# EAGLE design drawdio (EAGLE 5.01)
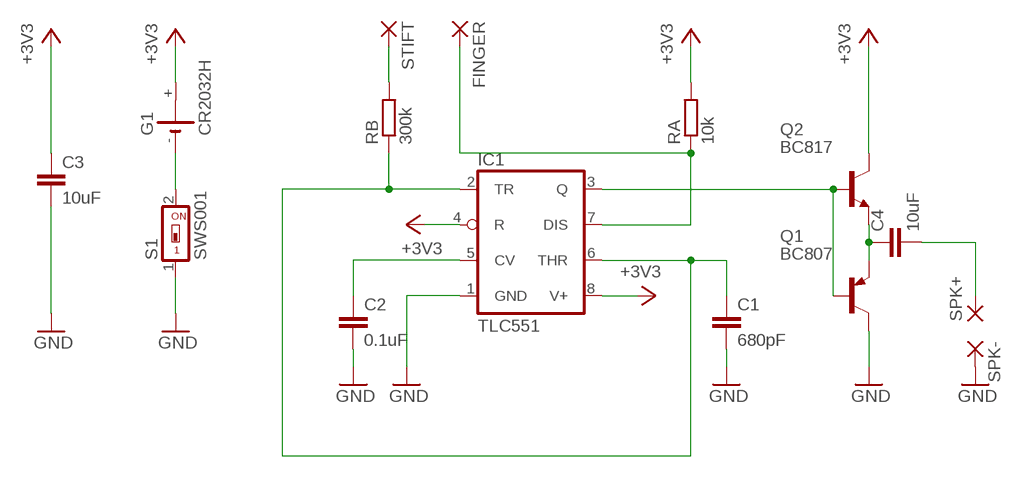
[diagram p0: schematic, sheet 1]

## Parts
C1  680pF  C-EUC1206  [C1206]
C2  0.1uF  C-EUC1206  [C1206]
C3  10uF  C-EUC1206  [C1206]
C4  10uF  C-EUC1206  [C1206]
FINGER  SMD2  [SMD1,27-2,54]
G1  CR2032H  [CR2032H]
IC1  TLC551  LM555D  [SO08]
Q1  BC807  BC807-25SMD  [SOT23-BEC]
Q2  BC817  BC817-25SMD  [SOT23-BEC]
RA  10k  R-EU_R1206  [R1206]
RB  300k  R-EU_R1206  [R1206]
S1  SWS001  [SMS-001]
SPK+  SMD2  [SMD1,27-2,54]
SPK-  SMD2  [SMD1,27-2,54]
STIFT  SMD2  [SMD1,27-2,54]

## Nets
+3V3: C3.1 G1.+ IC1.4(R) IC1.8(V+) Q2.C RA.2
GND: C1.2 C2.2 C3.2 IC1.1(GND) Q1.C S1.1 SPK-.1(P)
N$1: G1.- S1.2
N$2: C1.1 IC1.2(TR) IC1.6(THR) RB.1
N$3: RB.2 STIFT.1(P)
N$4: C2.1 IC1.5(CV)
N$5: FINGER.1(P) IC1.7(DIS) RA.1
N$6: IC1.3(Q) Q1.B Q2.B
N$8: C4.2 SPK+.1(P)
N$15: C4.1 Q1.E Q2.E
Unconnected: G1.+@1(+)

## Library data of the parts
C1-C4 = rcl:C-EU: CAPACITOR, European symbol
FINGER SPK+ SPK- STIFT = wirepad:SMD2: SMD PAD
G1 = battery:CR2032H: LI BATTERY Varta
IC1 = linear:*555: TIMER
Q1 = transistor-pnp:BC807*: PNP Transistror
Q2 = transistor-npn:BC817*: NPN Transistor
RA RB = resistor:R-EU_: RESISTOR, European symbol
S1 = smd-special:SWS001: SMD Dip Switch 1 pol.

## Board
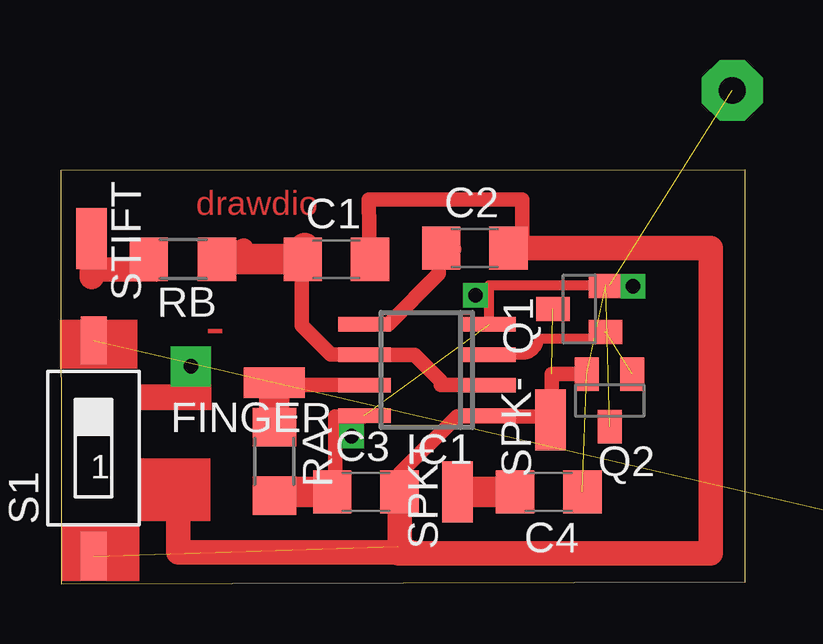
[diagram p1: board, top side]
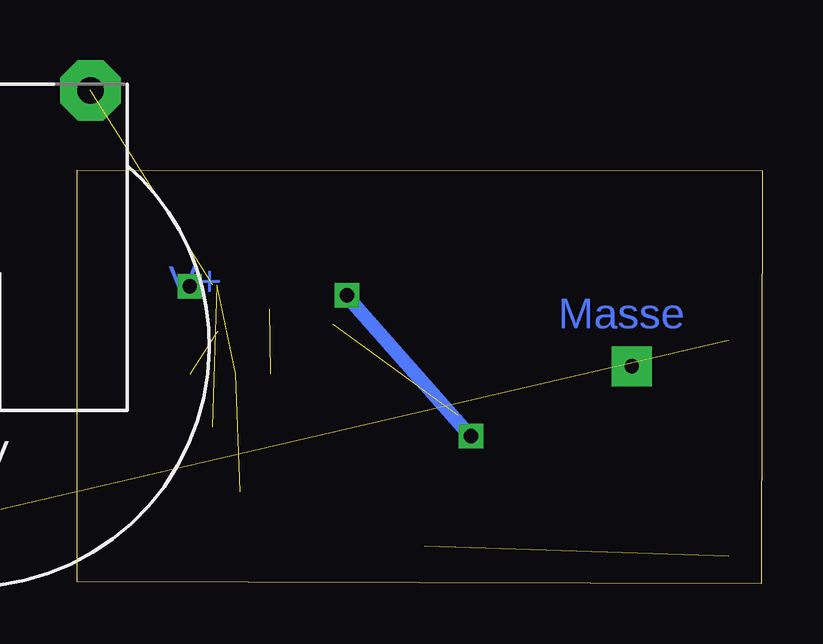
[diagram p2: board, bottom side, seen from below]

Size 28.52 x 17.24 mm. Coordinates in mm from the lower left corner, seen from the top.
Outline: 0.03,0 28.52,0.07 28.52,17.24 0,17.22 0.03,0
Copper layers (1*16): Top 0.035mm / dielectric 1.5mm / Bottom 0.035mm
Design rules "default": minimum track width 10mil, minimum drill 24mil, track to track 8mil, track to pad 8mil, pad to pad 8mil, via to via 8mil, smd to smd 8mil, copper to edge 40mil, drill to drill 8mil, minimum pad ring 10mil, minimum via ring 8mil, stop-mask expansion 4mil, vias tented up to drill 0mil, thermal gap 10mil

### Footprints (pad centres in the part's own frame; a part is rotated, then mirrored left to right if it is on the bottom)
C1206 = smd 1.6 x 1.8: 1 -1.4,0; 2 1.4,0
SMD1,27-2,54 = smd 1.27 x 2.54: 1 0,0
CR2032H = drill 1.118 pad 2.54 octagon: + 5.08,10.795; +@1 -5.08,10.795; - 0,-6.985
SO08 = smd 0.6 x 2.2: 1 -1.905,-2.6; 2 -0.635,-2.6; 3 0.635,-2.6; 4 1.905,-2.6; 5 1.905,2.6; 6 0.635,2.6; 7 -0.635,2.6; 8 -1.905,2.6
SOT23-BEC = smd 1 x 1.4: B -0.95,-1.1; C 0,1.1; E 0.95,-1.1
R1206 = smd 1.6 x 1.803: 1 -1.422,0; 2 1.422,0
SMS-001 = smd 1.092 x 2.007: 1 0,-4.496; 2 0,4.496

### Placement (x,y rotation side)
C1  11.49,13.53 0 top
C2  17.26,13.99 0 top
C3  12.72,3.83 0 top
C4  20.34,3.83 180 top
FINGER  8.91,8.37 90 top
G1  33.06,9.77 0 bottom
IC1  15.26,8.91 90 top
Q1  21.61,11.45 90 top
Q2  22.88,7.64 180 top
RA  8.91,5.1 270 top
RB  5.1,13.53 180 top
S1  1.38,5.64 0 top
SPK+  16.53,3.83 0 top
SPK-  20.42,6.83 0 top
STIFT  1.29,14.39 180 top

### Tracks (layer width: path | path; a pad name or v marks a point on that pad's centre or on a via)
+3V3  (3 unrouted)
  Top 0.406: 22.88,12.44 22.71,12.44 17.86,12.44 IC1.4
  Top 0.61: IC1.8 12.66,6.98 11.45,6.98 11.45,3.83
  Top 1.27: RA.2 8.91,3.83 C3.1 11.45,3.83
GND  (2 unrouted)
  Top 0.61: 17.92,6.98 17.86,6.98 IC1.1 17.89,7.01 17.92,6.98 | 17.92,6.98 20.38,6.98 | 20.34,6.43 20.31,6.43 | 20.34,6.43 SPK-.1 | 20.38,6.98 20.38,6.43 20.34,6.43 | C3.2 14.12,4.57 16.53,6.98 17.92,6.98 | C1.2 12.85,16.02 19.23,16.02 19.23,13.93 19.2,13.93 | 19.2,13.93 19.15,13.93 | C2.2 19.2,13.93 | 20.38,6.98 20.46,6.98 20.46,8.75 21.93,8.75 21.93,8.74
  Top 1.016: C3.2 14.12,3.81 14.14,3.81 14.14,1.57 | 14.14,1.57 14.14,1.41 | C2.2 27.1,13.99 27.1,1.26 14.06,1.26 14.06,1.57 14.14,1.57
N$1  (1 unrouted)
N$2
  Top 0.61: IC1.2 15.83,8.29 15.83,8.45 14.75,9.53 12.75,9.53 12.73,9.55 IC1.6 11.26,9.55 10.05,10.76 10.05,13.85 10.12,13.93 10.06,13.99 C1.1
  Top 0.813: RB.1 7.64,13.99
  Top 1.27: 10.18,13.99 C1.1 RB.1
N$3
  Top 0.813: STIFT.1 1.29,12.79
  Top 1.016: 1.29,12.79 1.29,13.1 3.95,13.1 3.95,13.49 3.68,13.49 RB.2
N$4
  Top 0.61: IC1.5 13.65,10.82 15.76,12.93 15.76,13.31 16.4,13.96 C2.1
N$5
  Top 0.61: IC1.7 8.91,8.29
  Top 1.27: RA.1 8.91,8.29 FINGER.1
N$6  (2 unrouted)
  Top 0.406: IC1.3 19.25,9.55 arc90 19.92,10.22 22.31,10.22 arc90 22.62,10.53 arc90 22.65,10.5
N$8
  Top 1.27: 19.07,3.83 C4.2 SPK+.1
N$9  (via drill 0.6 pad 1.68)
  other vias: 5.43,9.06
N$10  (via drill 0.6 pad 1.02)
  other vias: 23.84,12.41
N$11  (via drill 0.6 pad 1.02)
  other vias: 12.12,6.16
N$12  (via drill 0.6 pad 1.02)
  other vias: 17.29,12.02
N$13
  Bottom 0.61: 12.16,6.16 17.33,12.02 17.33,11.98
N$14
  Top 1.016: 14.64,1.3 4.91,1.3 4.91,3.37 4.82,3.33
N$15  (2 unrouted)
(copper drawn outside any net)
  shapes: Top area x4

### Text on the board
Top: drawdio | -
Bottom: V+ | Masse